# Altium project Batt_Management_Rev2.PrjPCB
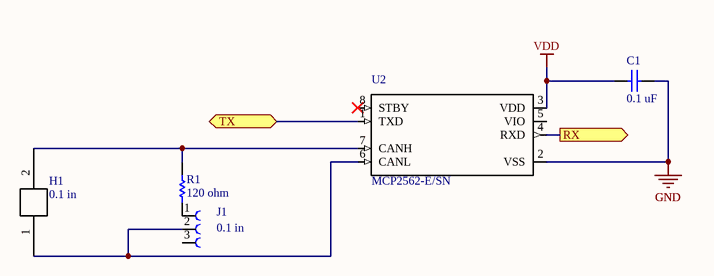
[diagram p0: CAN TRAN.SchDoc]
1 sheet, 5 parts. Net scope: flat (ports and power ports of the same name join across sheets).
Board file: Batt_Man_rev2.PcbDoc

## Sheet CAN TRAN.SchDoc
size A

### Parts
C1  0.1 uF  [CAPC0805(2012)130_N]
H1  0.1 in  [PCBComponent_1]
J1  0.1 in  [61300311121]
R1  120 ohm  [RESC0805(2012)_N]
U2  MCP2562-E/SN  [SOIC127P600X175-8N]

### Ports
RX (out), TX (bidir)

### Nets
GND: C1.1 U2.2(VSS)
VDD: C1.2 U2.3(VDD)
NetH1_1: H1.1 J1.2 U2.6(CANL)
NetH1_2: H1.2 R1.2 U2.7(CANH)
NetJ1_1: J1.1 R1.1
NetU2_1: U2.1(TXD) ; port TX
NetU2_4: U2.4(RXD) ; port RX

Not connected (* = marked no-connect by the designer): J1 3; U2 5(VIO) 8(STBY)*

### Library data of the parts
C1 = CMP-1036-02603-1: CAP 390pF 200V ±5% 0805 (2012 Metric) Thickness 1.3mm SMD; Case-Metric: 2012; Case-EIA: 0805; Tolerance: Â±5%; Max Thickness: 1.3 mm; Rated Voltage: 200 V; Technology: SMT; Value: 390pF
H1 = 0430450227: Molex micro-fit 3.0. Molex P/N 0430450227
J1 = 61300311121: Board-To-Board Connector, Vertical, WR-PHD Series, Through Hole, Header, 3, 2.54 mm; MF: Wurth Electronics; Package: None; MP: 61300311121; SnapEDA_Link: https://www.snapeda.com/parts/61300311121/Wurth%20Electronics%20Inc./view-part/?ref=snap; Availability: Unavailable; Price: None; Value: *
R1 = CMP-1013-00418-1: 160R 0.125W 1% 0805 (2012 Metric)  SMD; Case-Metric: 2012; Case-EIA: 0805; Value: 160.00 Ohm; Technology: SMT; Tolerance: 1 %; Power: 0.125 W
U2 = MCP2562-E/SN: Microchip MCP2562-E/SN, CAN Transceiver 1MBps 1-channel IEC 61000-4-2, 8-Pin SOIC; Price: None; MF: Microchip; SnapEDA_Link: https://www.snapeda.com/parts/MCP2562-E/SN/Microchip/view-part/?ref=snap; MP: MCP2562-E/SN; Availability: Unavailable; Package: SO-8 Microchip; Value: *; ComponentLink1Description: datasheet; ComponentLink1URL: http://www.ti.com/lit/ds/symlink/tcan332.pdf